# Altium schematic sheet DB10005_TopLevel.SchDoc: TopLevel schematic
size A3; SheetNumber: 1; SheetTotal: 7
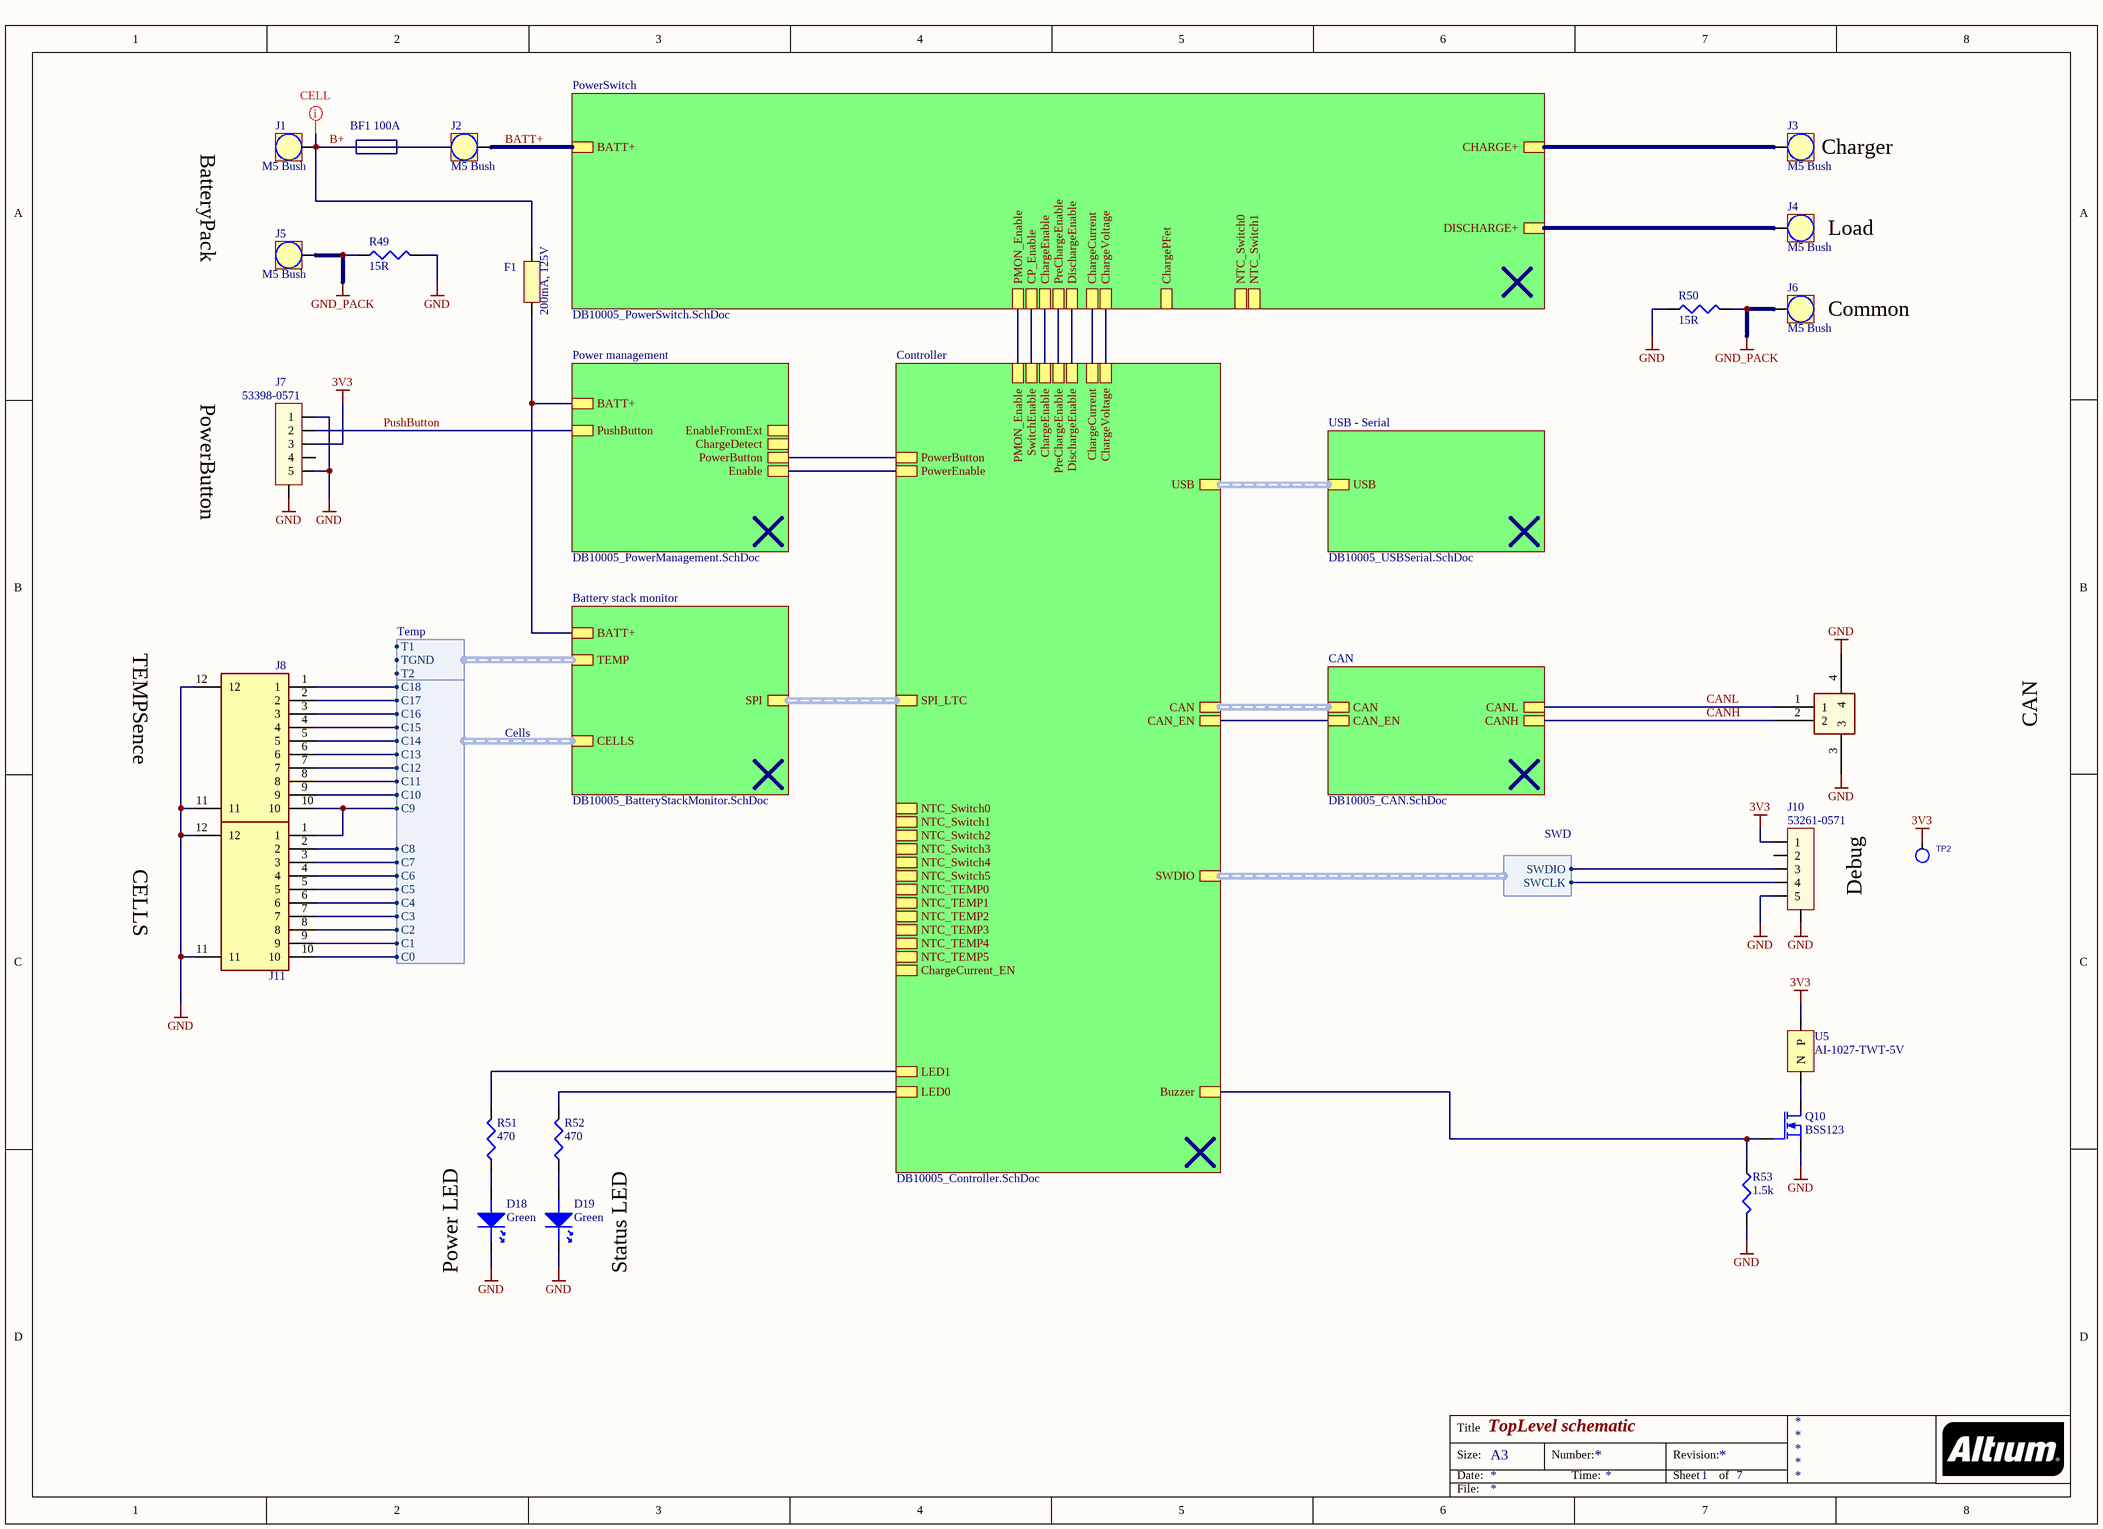
[diagram p0: DB10005_TopLevel.SchDoc]

## Parts
D18  Green  [D-0805]
D19  Green  [D-0805]
F1  200mA, 125V  [F1206]
J1  M5 Bush  [7460408_HAL Surface]
J2  M5 Bush  [7460408_HAL Surface]
J3  M5 Bush  [7460408_HAL Surface]
J4  M5 Bush  [7460408_HAL Surface]
J5  M5 Bush  [7460408_HAL Surface]
J6  M5 Bush  [7460408_HAL Surface]
J7  53398-0571  [53398-0571]
J8  S10B-PH-SM4-TB_LF__SN_  [S10B-PH-SM4-TB]  (value not drawn)
J9  1.25-2PWTDK  [BM02B-GHS-TBT_1]  (value not drawn)
J10  53261-0571  [53261-0571]
J11  S10B-PH-SM4-TB_LF__SN_  [S10B-PH-SM4-TB]  (value not drawn)
Q10  BSS123  [SOT-23]
R49  15R  [2512]
R50  15R  [2512]
R51  470  [0402]
R52  470  [0402]
R53  1.5k  [0402]
TP2  1.3TP  [TP2-1.3MM]  (value not drawn)  (no BOM)
U5  AI-1027-TWT-5V  [AI-1027-TWT]

## Sub-sheets
Battery stack monitor = DB10005_BatteryStackMonitor.SchDoc: SPI (harness SPI), CELLS (harness Cells), TEMP (harness Temp), BATT+
CAN = DB10005_CAN.SchDoc: CANH, CAN (harness CAN), CANL, CAN_EN
Controller = DB10005_Controller.SchDoc: SPI_LTC (harness SPI), PowerEnable, PowerButton, DischargeEnable, ChargeEnable, SwitchEnable, PreChargeEnable, CAN (harness CAN), LED0, SWDIO (harness SWD), Buzzer, LED1, PMON_Enable, CAN_EN, ChargeCurrent, ChargeVoltage, NTC_Switch0, NTC_Switch1, NTC_Switch2, NTC_Switch3, NTC_Switch4, NTC_Switch5, NTC_TEMP0, NTC_TEMP1, NTC_TEMP2, NTC_TEMP3, NTC_TEMP4, NTC_TEMP5, ChargeCurrent_EN, USB (harness USB)
Power management = DB10005_PowerManagement.SchDoc: Enable, PowerButton, ChargeDetect, EnableFromExt, PushButton, BATT+
PowerSwitch = DB10005_PowerSwitch.SchDoc: DischargeEnable, ChargeEnable, PreChargeEnable, CHARGE+, DISCHARGE+, BATT+, ChargePFet, CP_Enable, PMON_Enable, NTC_Switch0, NTC_Switch1, ChargeCurrent, ChargeVoltage
USB - Serial = DB10005_USBSerial.SchDoc: USB (harness USB)

## Harnesses
Cells: C1, C9, C2, C3, C4, C5, C6, C7, C8, C10, C11, C0, C12, C13, C14, C15, C16, C17, C18
Temp: T1, T2, TGND
SWD: SWCLK, SWDIO

## Nets
3V3: J7.3 J10.1 TP2.1(TP) U5.P
GND: D18.K D19.K J7.0(SHLD) J7.1 J7.5 J8.11 J8.12 J9.3 J9.4 J10.0(SHLD) J10.5 J11.11 J11.12 Q10.S R49.2 R50.2 R53.2
GND_PACK: J5.1 J6.1 R49.1 R50.1
B+: F1.2 J1.1
BATT+: J2.1 ; sheet PowerSwitch/BATT+
CANH: J9.2 ; sheet CAN/CANH
CANL: J9.1 ; sheet CAN/CANL
PushButton: J7.2 ; sheet Power management/PushButton
NetD18_A: D18.A R51.1
NetD19_A: D19.A R52.1
NetF1_1: F1.1 ; sheet Battery stack monitor/BATT+, sheet Power management/BATT+
NetJ3_1: J3.1 ; sheet PowerSwitch/CHARGE+
NetJ4_1: J4.1 ; sheet PowerSwitch/DISCHARGE+
NetJ8_1: J8.1 ; sheet Battery stack monitor/CELLS.C18
NetJ8_2: J8.2 ; sheet Battery stack monitor/CELLS.C17
NetJ8_3: J8.3 ; sheet Battery stack monitor/CELLS.C16
NetJ8_4: J8.4 ; sheet Battery stack monitor/CELLS.C15
NetJ8_5: J8.5 ; sheet Battery stack monitor/CELLS.C14
NetJ8_6: J8.6 ; sheet Battery stack monitor/CELLS.C13
NetJ8_7: J8.7 ; sheet Battery stack monitor/CELLS.C12
NetJ8_8: J8.8 ; sheet Battery stack monitor/CELLS.C11
NetJ8_9: J8.9 ; sheet Battery stack monitor/CELLS.C10
NetJ8_10: J8.10 J11.1 ; sheet Battery stack monitor/CELLS.C9
NetJ10_3: J10.3 ; sheet Controller/SWDIO.SWDIO
NetJ10_4: J10.4 ; sheet Controller/SWDIO.SWCLK
NetJ11_2: J11.2 ; sheet Battery stack monitor/CELLS.C8
NetJ11_3: J11.3 ; sheet Battery stack monitor/CELLS.C7
NetJ11_4: J11.4 ; sheet Battery stack monitor/CELLS.C6
NetJ11_5: J11.5 ; sheet Battery stack monitor/CELLS.C5
NetJ11_6: J11.6 ; sheet Battery stack monitor/CELLS.C4
NetJ11_7: J11.7 ; sheet Battery stack monitor/CELLS.C3
NetJ11_8: J11.8 ; sheet Battery stack monitor/CELLS.C2
NetJ11_9: J11.9 ; sheet Battery stack monitor/CELLS.C1
NetJ11_10: J11.10 ; sheet Battery stack monitor/CELLS.C0
NetQ10_D: Q10.D U5.N
NetQ10_G: Q10.G R53.1 ; sheet Controller/Buzzer
NetR51_2: R51.2 ; sheet Controller/LED1
NetR52_2: R52.2 ; sheet Controller/LED0
(unnamed): sheet Controller/PowerEnable, sheet Power management/Enable
(unnamed): sheet Controller/PowerButton, sheet Power management/PowerButton
(unnamed): sheet Controller/DischargeEnable, sheet PowerSwitch/DischargeEnable
(unnamed): sheet Controller/ChargeEnable, sheet PowerSwitch/ChargeEnable
(unnamed): sheet Controller/SwitchEnable, sheet PowerSwitch/CP_Enable
(unnamed): sheet Controller/PreChargeEnable, sheet PowerSwitch/PreChargeEnable
(unnamed): sheet Controller/PMON_Enable, sheet PowerSwitch/PMON_Enable
(unnamed): sheet Controller/CAN_EN, sheet CAN/CAN_EN
(unnamed): sheet Controller/ChargeCurrent, sheet PowerSwitch/ChargeCurrent
(unnamed): sheet Controller/ChargeVoltage, sheet PowerSwitch/ChargeVoltage

Not connected (* = marked no-connect by the designer): J7 4; J10 2

## Buses and harness runs
harness sheet Battery stack monitor/SPI = sheet Controller/SPI_LTC
harness sheet CAN/CAN = sheet Controller/CAN
harness sheet Controller/USB = sheet USB - Serial/USB

## Layout directives
net class CELL: B+

## Notes on the sheet
- (near J1) BF1 100A
- BatteryPack
- (near J3) Charger
- (near J4) Load
- (near J6) Common
- PowerButton
- TEMPSence
- CAN
- CELLS
- Debug
- Power LED
- Status LED
- Title
- Size:
- Date:
- A3
- Number:
- Time:
- Revision:
- Sheet
- of
- File:

## Library data of the parts
D18 D19 = KP-2012SGC: Led, Green, Li:12mcd, Vf:2.2V, If:0.02A; Brand: KingBright; Case Style: 0805; Forward Current: 0.02A; Forward Voltage: 2.2V; Luminous Intensity: 12mcd; Brand Number: KP-2012SGC; Order Code Supplier: 1318243; Price: 0,06; Supplier: Farnell; Temperature Range: -30°C to +85°C
F1 = 0466.200NR: Fuse, Slow Blow, 200 mA, 125 VAC, 125 VDC; Brand: LITTELFUSE; Prijs: 0,347; Order Code Supplier: 1596522; Brand Number: 0466.200NR; Supplier: Farnell
J1-J6 = 7460408: Bush with Circumference M5; Brand: Wurth; Case Style: M5Bush; Brand Number: 7460408; Order Code Supplier: 1821279; Price: 4,17; Supplier: Farnell
J7 = 53398-0571: PicoBlade 53398 Series, 5Pin, Right Angle; Brand: MOLEX; Pitch: 1.25mm; Brand Number: 53398-0571; Case Style: 53398-0571; Order Code Supplier: 1125354; Price: 1,55; Supplier: Farnell
J8 J11 = S10B-PH-SM4-TB_LF__SN_: Connector; Manufacturer_Name: JST (JAPAN SOLDERLESS TERMINALS); Manufacturer_Part_Number: S10B-PH-SM4-TB(LF)(SN); Description: PH SMT side entry shroud header 10 way JST PH Series; Datasheet Link: http://uk.rs-online.com/web/p/products/6881350; Mouser Part Number: 306-S10BPHSM4TBLFSN; Mouser Price/Stock: https://www.mouser.co.uk/ProductDetail/JST-Commercial/S10B-PH-SM4-TBLFSN?qs=QpmGXVUTftH7ZRPAPdrNVw%3D%3D; Arrow Part Number: S10B-PH-SM4-TB(LF)(SN); Arrow Price/Stock: https://www.arrow.com/en/products/s10b-ph-sm4-tb-lf-sn/jst-manufacturing?region=nac
J10 = 53261-0571: PicoBlade 53261 Series, 5Pin, Right Angle; Brand: MOLEX; Pitch: 1.25mm; Brand Number: 53261-0571; Case Style: 53261-0571; Order Code Supplier: 1125360; Price: 1,20; Supplier: Farnell
Q10 = BSS123: Mosfet, N-channel, Vds:100V, Id:0.15A, Vgs-th:2.8V, Rds-on:3.5ohm; Brand: NXP; Drain Current: 0.15A; Drain Source Voltage: 100V; Gate Source Voltage: 20V; On Resistance: 3.5ohm; Threshold Voltage: 2.8V; Brand Number: BSS123; Case Style: SOT-23; Order Code Supplier: 1510764; Price: 0,082; Supplier: Farnell; Temperature Range: -55°C to +150°C; Transistor Polarity: N-channel
R49 R50 = 15/2512/2W/250V: Resistor, 15R, 1%, 2W, 200V, 200PPM, 2512; Brand: TE CONNECTIVITY / CGS; Brand Number: 352115RFT; Voltage Rating: 250V; Case Style: 2512; Order Code Supplier: 2117454; Power Rating: 2W; Price: 0,30; Resistance: 15R; Supplier: Farnell; Temperature Coefficient: ± 200PPM; Temperature Range: -55°C to +125°C
R51 R52 = 470/0402/0063W/50V: Resistor, 470, 1%, 0.0625W, 50V, 100PPM, 0402; Brand: VISHAY DRALORIC; Brand Number: CRG0402F470R; Power Rating: 0.063W; Case Style: 0402; Order Code Supplier: 2331533; Price: 0,0099; Resistance: 470; Supplier: Farnell; Temperature Coefficient: ± 100PPM; Temperature Range: -55°C to +125°C; Voltage Rating: 50V
R53 = 1.5k/0402/0063W/50V: Resistor, 1.5k, 0.1%, 0.0625W, 50V, 100PPM, 0402; Brand: VISHAY DRALORIC; Brand Number: CRCW04021K50FKED; Power Rating: 0.063W; Case Style: 0402; Order Code Supplier: 2121624; Price: 0,0054; Resistance: 1.5k; Supplier: Farnell; Temperature Coefficient: ± 100PPM; Temperature Range: -55°C to +125°C; Voltage Rating: 50V
TP2 = TESTPT4: 1.3mm
U5 = AI-1027-TWT-5V-2-R: EM 5VDC 2300Hz 82dBA Continuous Top Fire; Brand: PUI Audio; Brand Number: AI-1027-TWT-5V-2-R; Case Style: AI-1027-TWT-5V-2-R; Price: 1,73; Order Code Supplier: 665-AI1027TWT5V2R; Supplier: Mouser